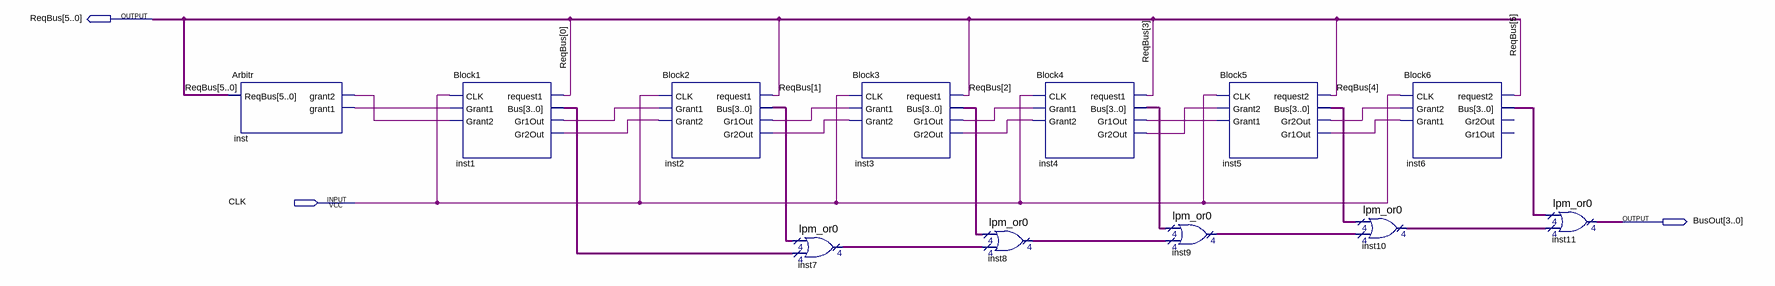
[diagram p0: schematic sheet]
// Quartus schematic Sif5.bdf as structural Verilog: 12 symbols, 3 pins
module Sif5 (
  input  CLK,
  output [5:0] ReqBus,
  output [3:0] BusOut
);

  wire inst1_gr1out, inst1_gr2out, inst2_gr1out, inst2_gr2out, inst3_gr1out, inst3_gr2out, inst4_gr1out,
       inst4_gr2out, inst5_gr1out, inst5_gr2out, inst_grant1, inst_grant2;
  wire [3:0] inst1_bus, inst2_bus, inst3_bus, inst4_bus, inst5_bus, inst6_bus, inst7_result, inst8_result,
       inst9_result, inst10_result;

  Arbitr inst (.ReqBus(ReqBus), .grant2(inst_grant2), .grant1(inst_grant1));
  Block1 inst1 (
    .CLK(CLK), .Grant1(inst_grant1), .Grant2(inst_grant2), .request1(ReqBus[0]), .Bus(inst1_bus),
    .Gr1Out(inst1_gr1out), .Gr2Out(inst1_gr2out));
  Block2 inst2 (
    .CLK(CLK), .Grant1(inst1_gr1out), .Grant2(inst1_gr2out), .request1(ReqBus[1]), .Bus(inst2_bus),
    .Gr1Out(inst2_gr1out), .Gr2Out(inst2_gr2out));
  lpm_or0 inst7 (.data0x(inst2_bus), .data1x(inst1_bus), .result(inst7_result));
  Block3 inst3 (
    .CLK(CLK), .Grant1(inst2_gr1out), .Grant2(inst2_gr2out), .request1(ReqBus[2]), .Bus(inst3_bus),
    .Gr1Out(inst3_gr1out), .Gr2Out(inst3_gr2out));
  lpm_or0 inst8 (.data0x(inst3_bus), .data1x(inst7_result), .result(inst8_result));
  Block4 inst4 (
    .CLK(CLK), .Grant1(inst3_gr1out), .Grant2(inst3_gr2out), .request1(ReqBus[3]), .Bus(inst4_bus),
    .Gr1Out(inst4_gr1out), .Gr2Out(inst4_gr2out));
  lpm_or0 inst9 (.data0x(inst4_bus), .data1x(inst8_result), .result(inst9_result));
  Block5 inst5 (
    .CLK(CLK), .Grant2(inst4_gr2out), .Grant1(inst4_gr1out), .request2(ReqBus[4]), .Bus(inst5_bus),
    .Gr2Out(inst5_gr2out), .Gr1Out(inst5_gr1out));
  lpm_or0 inst10 (.data0x(inst5_bus), .data1x(inst9_result), .result(inst10_result));
  Block6 inst6 (
    .CLK(CLK), .Grant2(inst5_gr2out), .Grant1(inst5_gr1out), .request2(ReqBus[5]), .Bus(inst6_bus));  // open: Gr2Out, Gr1Out
  lpm_or0 inst11 (.data0x(inst6_bus), .data1x(inst10_result), .result(BusOut));
endmodule
